# EAGLE design BusCon (EAGLE 6.6.0)
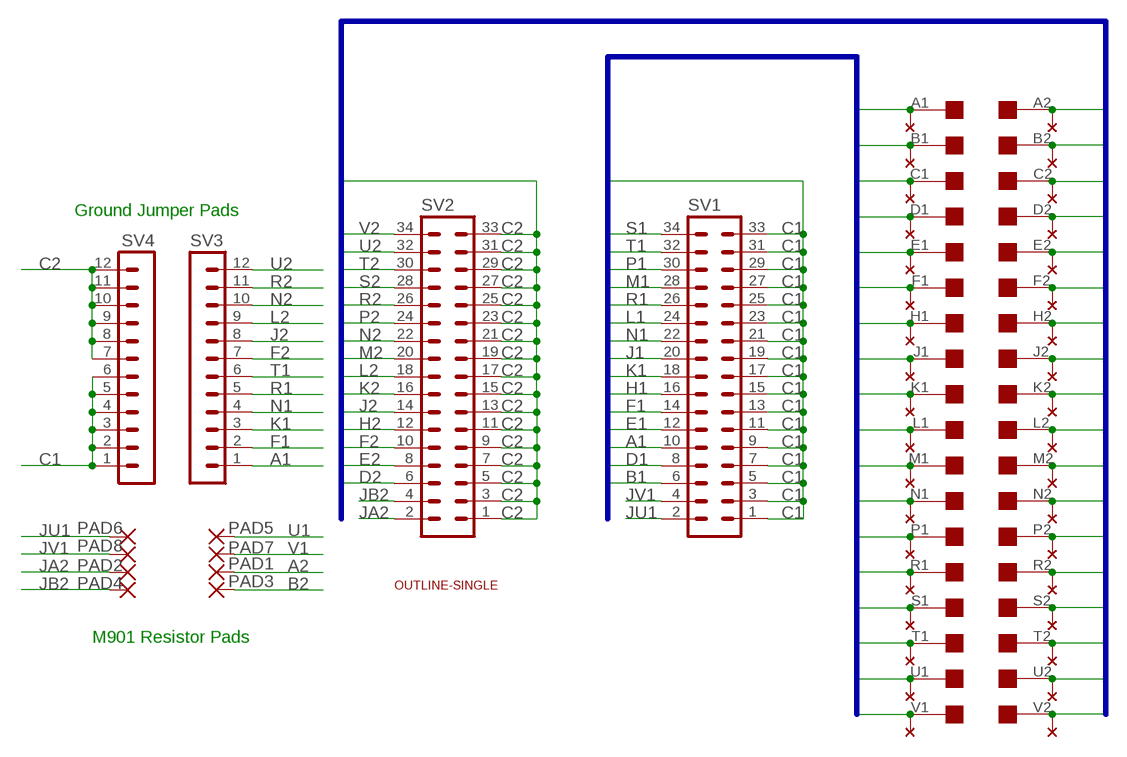
[diagram p0: schematic, sheet 1]

## Parts
PAD1  1,6/0,8  [1,6/0,8]
PAD2  1,6/0,8  [1,6/0,8]
PAD3  1,6/0,8  [1,6/0,8]
PAD4  1,6/0,8  [1,6/0,8]
PAD5  1,6/0,8  [1,6/0,8]
PAD6  1,6/0,8  [1,6/0,8]
PAD7  1,6/0,8  [1,6/0,8]
PAD8  1,6/0,8  [1,6/0,8]
SV1  MA17-2  [MA17-2]
SV2  MA17-2  [MA17-2]
SV3  MA12-1  [MA12-1]
SV4  MA12-1  [MA12-1]
U$1  OUTLINE-SINGLE  [SINGLE]
U$4  SINGLE  [EDGE-CON2]
U$5  THRU-HOLE2C  [THRU-HOLEC]

## Nets
A1: SV1.10 SV3.1 U$4.A1 U$5.A1
A2: PAD1.1(P) U$4.A2 U$5.A2
B1: SV1.6 U$4.B1 U$5.B1
B2: PAD3.1(P) U$4.B2 U$5.B2
C1: SV1.1 SV1.3 SV1.5 SV1.7 SV1.9 SV1.11 SV1.13 SV1.15 SV1.17 SV1.19 SV1.21 SV1.23 SV1.25 SV1.27 SV1.29 SV1.31 SV1.33 SV4.1 SV4.2 SV4.3 SV4.4 SV4.5 SV4.6 U$4.C1 U$5.C1
C2: SV2.1 SV2.3 SV2.5 SV2.7 SV2.9 SV2.11 SV2.13 SV2.15 SV2.17 SV2.19 SV2.21 SV2.23 SV2.25 SV2.27 SV2.29 SV2.31 SV2.33 SV4.7 SV4.8 SV4.9 SV4.10 SV4.11 SV4.12 U$4.C2 U$5.C2
D1: SV1.8 U$4.D1 U$5.D1
D2: SV2.6 U$4.D2 U$5.D2
E1: SV1.12 U$4.E1 U$5.E1
E2: SV2.8 U$4.E2 U$5.E2
F1: SV1.14 SV3.2 U$4.F1 U$5.F1
F2: SV2.10 SV3.7 U$4.F2 U$5.F2
H1: SV1.16 U$4.H1 U$5.H1
H2: SV2.12 U$4.H2 U$5.H2
J1: SV1.20 U$4.J1 U$5.J1
J2: SV2.14 SV3.8 U$4.J2 U$5.J2
JA2: PAD2.1(P) SV2.2
JB2: PAD4.1(P) SV2.4
JU1: PAD6.1(P) SV1.2
JV1: PAD8.1(P) SV1.4
K1: SV1.18 SV3.3 U$4.K1 U$5.K1
K2: SV2.16 U$4.K2 U$5.K2
L1: SV1.24 U$4.L1 U$5.L1
L2: SV2.18 SV3.9 U$4.L2 U$5.L2
M1: SV1.28 U$4.M1 U$5.M1
M2: SV2.20 U$4.M2 U$5.M2
N1: SV1.22 SV3.4 U$4.N1 U$5.N1
N2: SV2.22 SV3.10 U$4.N2 U$5.N2
P1: SV1.30 U$4.P1 U$5.P1
P2: SV2.24 U$4.P2 U$5.P2
R1: SV1.26 SV3.5 U$4.R1 U$5.R1
R2: SV2.26 SV3.11 U$4.R2 U$5.R2
S1: SV1.34 U$4.S1 U$5.S1
S2: SV2.28 U$4.S2 U$5.S2
T1: SV1.32 SV3.6 U$4.T1 U$5.T1
T2: SV2.30 U$4.T2 U$5.T2
U1: PAD5.1(P) U$4.U1 U$5.U1
U2: SV2.32 SV3.12 U$4.U2 U$5.U2
V1: PAD7.1(P) U$4.V1 U$5.V1
V2: SV2.34 U$4.V2 U$5.V2

## Buses
A1,B1,C1,D1,E1,F1,H1,J1,K1,L1,M1,N1,P1,R1,S1,T1,U1,V1
A2,B2,C2,D2,E2,F2,H2,J2,K2,L2,M2,N2,P2,R2,S2,T2,U2,V2

## Notes on the sheet
- Ground Jumper Pads
- M901 Resistor Pads

## Library data of the parts
PAD1-PAD8 = wirepad:1,6/0,8: THROUGH-HOLE PAD
SV1 SV2 = con-lstb:MA17-2: PIN HEADER; OC_FARNELL: unknown; OC_NEWARK: unknown
SV3 SV4 = con-lstb:MA12-1: PIN HEADER; OC_FARNELL: unknown; OC_NEWARK: unknown
U$1 = dec-con:OUTLINE-*: Board outlines for DEC boards.
U$4 = dec-con:SINGLE: Single-Height DEC board
U$5 = dec-con:THRU-HOLE2: Thru-Hole addition to double-sided edge connector.

## Board
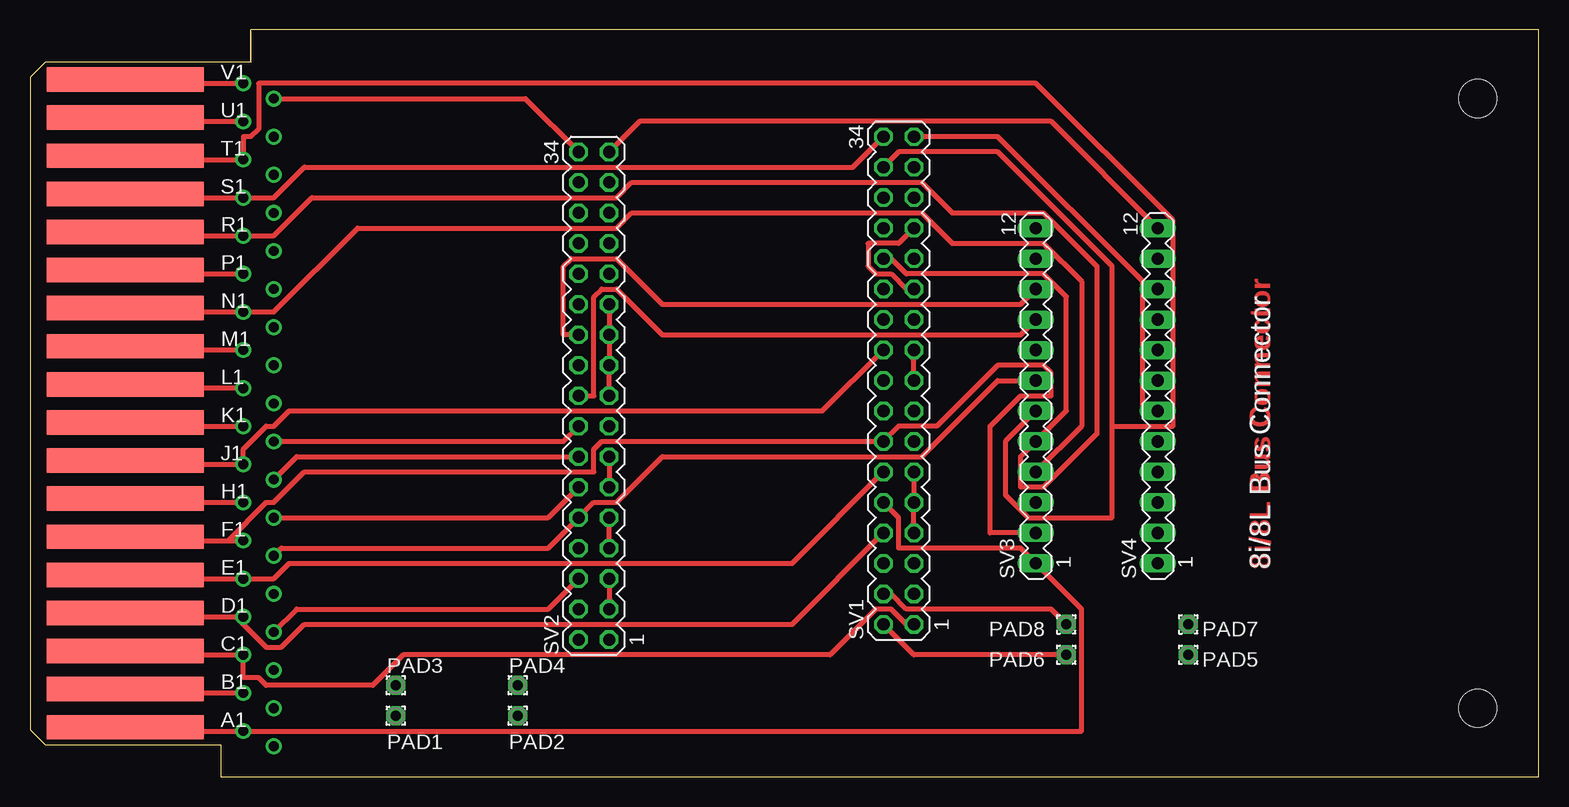
[diagram p1: board, top side]
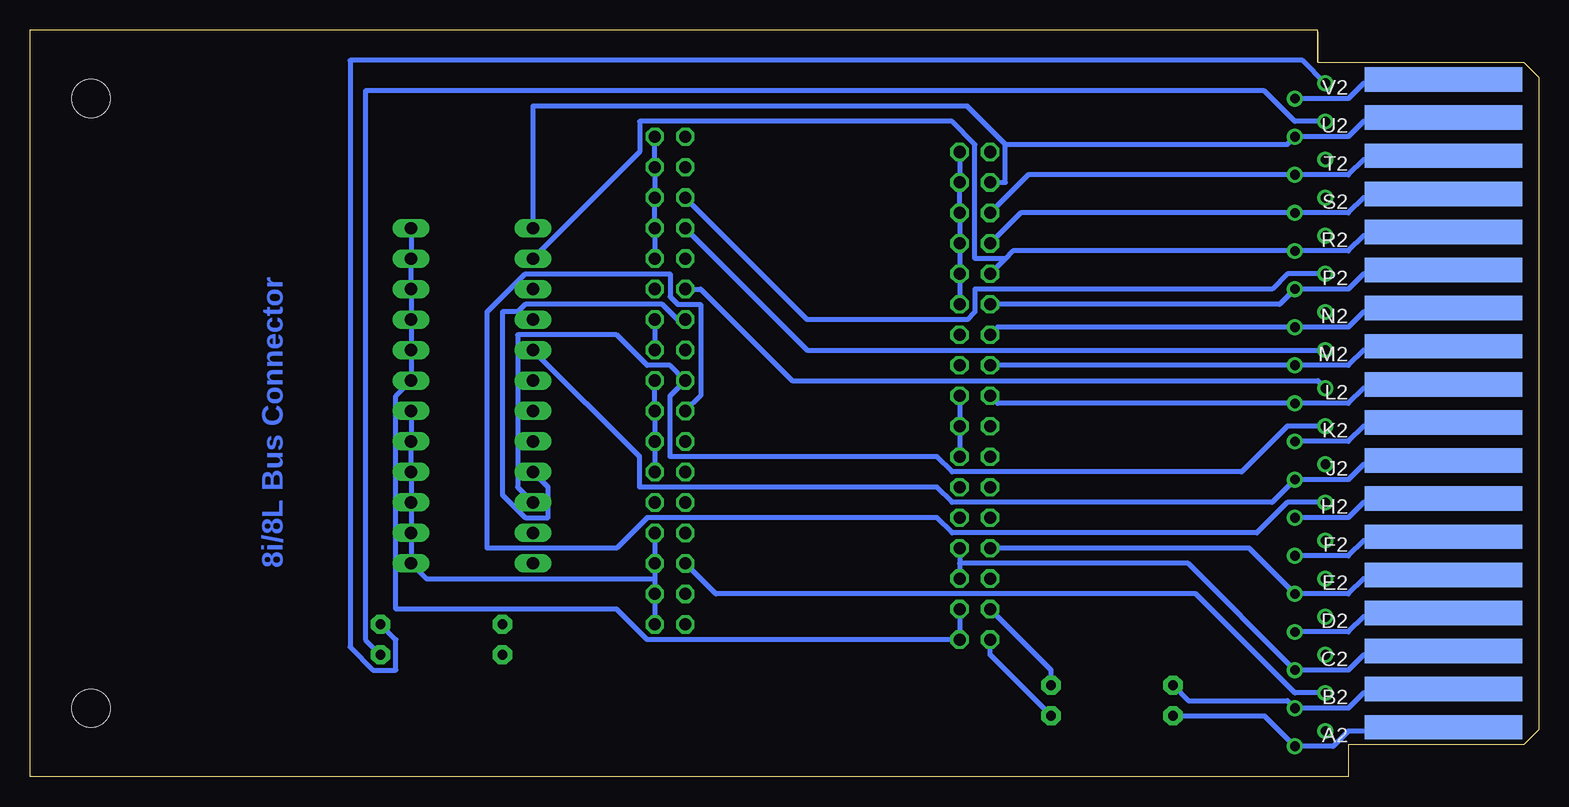
[diagram p2: board, bottom side, seen from below]

Size 125.73 x 62.23 mm. Coordinates in mm from the lower left corner, seen from the top.
Copper layers (1+16): Top 0.035mm / dielectric 1.5mm / Bottom 0.035mm
Design rules "16mils": minimum track width 16mil, minimum drill 32mil, track to track 15mil, track to pad 10mil, pad to pad 10mil, via to via 10mil, smd to smd 10mil, copper to edge 13mil, drill to drill 10mil, minimum pad ring 10mil, minimum via ring 8mil, stop-mask expansion 0mil, vias tented up to drill 0mil, thermal gap 10mil

### Footprints (pad centres in the part's own frame; a part is rotated, then mirrored left to right if it is on the bottom)
1,6/0,8 = drill 0.813 pad 1.6 octagon: 1 0,0
MA17-2 = drill 1.016 octagon: 1 -20.32,-1.27; 2 -20.32,1.27; 3 -17.78,-1.27; 4 -17.78,1.27; 5 -15.24,-1.27; 6 -15.24,1.27; 7 -12.7,-1.27; 8 -12.7,1.27; 9 -10.16,-1.27; 10 -10.16,1.27; 11 -7.62,-1.27; 12 -7.62,1.27; 13 -5.08,-1.27; 14 -5.08,1.27; 15 -2.54,-1.27; 16 -2.54,1.27; 17 0,-1.27; 18 0,1.27; 19 2.54,-1.27; 20 2.54,1.27; 21 5.08,-1.27; 22 5.08,1.27; 23 7.62,-1.27; 24 7.62,1.27; 25 10.16,-1.27; 26 10.16,1.27; 27 12.7,-1.27; 28 12.7,1.27; 29 15.24,-1.27; 30 15.24,1.27; 31 17.78,-1.27; 32 17.78,1.27; 33 20.32,-1.27; 34 20.32,1.27
MA12-1 = drill 1.016 long: 1 -13.97,0; 2 -11.43,0; 3 -8.89,0; 4 -6.35,0; 5 -3.81,0; 6 -1.27,0; 7 1.27,0; 8 3.81,0; 9 6.35,0; 10 8.89,0; 11 11.43,0; 12 13.97,0
SINGLE = hole 3.175: 120.65,56.515; 120.65,5.715
EDGE-CON2 = smd 13.106 x 2.032: A1 7.938,4.128; B1 7.938,7.303; C1 7.938,10.477; D1 7.938,13.652; E1 7.938,16.828; F1 7.938,20.003; H1 7.938,23.177; J1 7.938,26.352; K1 7.938,29.527; L1 7.938,32.703; M1 7.938,35.877; N1 7.938,39.053; P1 7.938,42.227; R1 7.938,45.403; S1 7.938,48.578; T1 7.938,51.752; U1 7.938,54.928; V1 7.938,58.102 | smd 13.106 x 2.032 bottom: A2 7.938,4.128; B2 7.938,7.303; C2 7.938,10.477; D2 7.938,13.652; E2 7.938,16.828; F2 7.938,20.003; H2 7.938,23.177; J2 7.938,26.352; K2 7.938,29.527; L2 7.938,32.703; M2 7.938,35.877; N2 7.938,39.053; P2 7.938,42.227; R2 7.938,45.403; S2 7.938,48.578; T2 7.938,51.752; U2 7.938,54.928; V2 7.938,58.102
THRU-HOLEC = drill 0.813 pad 1.27: A1 17.78,3.81; A2 20.32,2.54; B1 17.78,6.985; B2 20.32,5.715; C1 17.78,10.16; C2 20.32,8.89; D1 17.78,13.335; D2 20.32,12.065; E1 17.78,16.51; E2 20.32,15.24; F1 17.78,19.685; F2 20.32,18.415; H1 17.78,22.86; H2 20.32,21.59; J1 17.78,26.035; J2 20.32,24.765; K1 17.78,29.21; K2 20.32,27.94; L1 17.78,32.385; L2 20.32,31.115; M1 17.78,35.56; M2 20.32,34.29; N1 17.78,38.735; N2 20.32,37.465; P1 17.78,41.91; P2 20.32,40.64; R1 17.78,45.085; R2 20.32,43.815; S1 17.78,48.26; S2 20.32,46.99; T1 17.78,51.435; T2 20.32,50.165; U1 17.78,54.61; U2 20.32,53.34; V1 17.78,57.785; V2 20.32,56.515

### Placement (x,y rotation side)
PAD1  30.48,5.08 0 top
PAD2  40.64,5.08 0 top
PAD3  30.48,7.62 0 top
PAD4  40.64,7.62 0 top
PAD5  96.52,10.16 180 top
PAD6  86.36,10.16 180 top
PAD7  96.52,12.7 180 top
PAD8  86.36,12.7 180 top
SV1  72.39,33.02 90 top
SV2  46.99,31.75 90 top
SV3  83.82,31.75 90 top
SV4  93.98,31.75 90 top
U$1  0,0 0 top
U$4  0,0 0 top
U$5  0,0 0 top

### Tracks (layer width: path | path; a pad name or v marks a point on that pad's centre or on a via)
A1
  Top 0.406: SV1.10 72.39,21.59 72.39,19.05 82.55,19.05 SV3.1 87.63,13.97 87.63,3.81 U$5.A1 8.26,3.81 U$4.A1
A2
  Bottom 0.406: PAD1.1 22.86,5.08 U$5.A2 17.15,2.54 15.88,3.81 8.26,3.81 U$4.A2
B1
  Top 0.406: U$5.B1 8.26,6.99 U$4.B1
  Bottom 0.406: SV1.6 68.58,15.24 28.58,15.24 20.32,6.99 U$5.B1
B2
  Bottom 0.406: PAD3.1 29.21,6.35 20.96,6.35 U$5.B2 15.88,5.71 14.61,6.99 8.26,6.99 U$4.B2
C1
  Top 0.406: U$4.C1 8.26,10.16 U$5.C1 17.78,8.26 19.05,8.26 19.69,7.62 28.58,7.62 31.12,10.16 66.68,10.16 70.49,13.97 71.76,13.97 73.03,12.7 SV1.1 | SV1.11 SV1.9 SV1.7 | SV1.17 SV1.19 | SV1.23 73.03,40.64 71.76,41.91 70.49,41.91 69.85,42.55 69.85,44.45 72.39,44.45 SV1.27 | SV1.33 80.65,53.34 92.71,41.27 92.71,30.48 SV4.6
  Bottom 0.406: SV1.21 SV1.19 | SV1.17 SV1.15 SV1.13 SV1.11 | SV1.33 SV1.31 SV1.29 SV1.27 SV1.25 | SV1.1 SV1.3 73.66,16.51 | SV1.7 SV1.5 73.66,16.51 | SV4.6 SV4.5 SV4.4 SV4.3 SV4.2 SV4.1 92.71,16.51 73.66,16.51
C2
  Top 0.406: SV2.13 SV2.11 | SV2.17 SV2.19 SV2.21 SV2.23 | SV2.7 SV2.9 | SV2.5 SV2.3 | SV2.33 50.8,54.61 85.09,54.61 SV4.12
  Bottom 0.406: SV2.17 SV2.15 SV2.13 | SV2.33 SV2.31 SV2.29 SV2.27 SV2.25 SV2.23 | SV4.12 SV4.11 SV4.10 SV4.9 SV4.8 SV4.7 95.25,31.75 95.25,13.97 76.84,13.97 74.3,11.43 SV2.1 SV2.3 | SV2.7 48.26,17.78 | 48.26,17.78 SV2.5 | U$4.C2 8.26,10.16 14.61,10.16 15.88,8.89 U$5.C2 29.21,17.78 48.26,17.78
D1
  Top 0.406: 17.15,13.34 8.26,13.34 U$4.D1 | SV1.8 63.5,12.7 22.86,12.7 20.96,10.79 19.69,10.79 17.15,13.34 | 17.15,13.34 U$5.D1
D2
  Top 0.406: SV2.6 43.18,13.97 22.23,13.97 U$5.D2
  Bottom 0.406: U$5.D2 15.88,12.06 14.61,13.34 8.26,13.34 U$4.D2
E1
  Top 0.406: U$4.E1 8.26,16.51 U$5.E1 20.32,16.51 21.59,17.78 63.5,17.78 SV1.12
E2
  Bottom 0.406: U$4.E2 8.26,16.51 14.61,16.51 15.88,15.24 U$5.E2 24.13,19.05 SV2.8
F1
  Top 0.406: SV3.2 80.01,20.32 80.01,29.21 82.55,31.75 85.09,31.75 85.09,33.66 84.46,34.29 80.65,34.29 75.57,29.21 72.39,29.21 SV1.14 47.63,27.94 46.99,27.3 46.99,25.4 22.86,25.4 20.32,22.86 19.69,22.86 16.51,19.68 | 16.51,19.68 8.26,19.68 U$4.F1 | 16.51,19.68 U$5.F1
F2
  Top 0.406: U$5.F2 20.96,19.05 43.18,19.05 SV2.10 46.99,22.86 48.9,22.86 52.71,26.67 74.3,26.67 80.65,33.02 SV3.7
  Bottom 0.406: U$5.F2 15.88,18.41 14.61,19.68 8.26,19.68 U$4.F2
H1
  Top 0.406: U$5.H1 8.26,22.86 U$4.H1
  Bottom 0.406: SV1.16 69.85,31.75 69.85,39.37 71.76,39.37 72.39,40.01 72.39,41.91 84.46,41.91 87.63,38.73 87.63,19.05 76.84,19.05 74.3,21.59 50.17,21.59 48.9,20.32 23.5,20.32 20.96,22.86 U$5.H1
H2
  Top 0.406: SV2.12 43.18,21.59 U$5.H2
  Bottom 0.406: U$5.H2 15.88,21.59 14.61,22.86 8.26,22.86 U$4.H2
J1
  Top 0.406: U$4.J1 8.26,26.04 16.51,26.04 U$5.J1 17.78,27.3 19.69,29.21 20.32,29.21 21.59,30.48 66.04,30.48 SV1.20
J2
  Top 0.406: SV2.14 22.23,26.67 U$5.J2
  Bottom 0.406: U$4.J2 8.26,26.04 14.61,26.04 15.88,24.77 U$5.J2 22.23,22.86 48.9,22.86 50.17,24.13 74.93,24.13 74.93,26.67 SV3.8
JA2
  Bottom 0.406: SV2.2 45.72,10.16 PAD2.1
JB2
  Bottom 0.406: SV2.4 40.64,8.89 PAD4.1
JU1
  Top 0.406: SV1.2 73.66,10.16 PAD6.1
JV1
  Top 0.406: SV1.4 71.76,15.24 73.03,13.97 85.09,13.97 PAD8.1
K1
  Top 0.406: U$5.K1 8.26,29.21 U$4.K1
  Bottom 0.406: SV3.3 85.09,24.13 85.09,36.83 76.84,36.83 74.3,34.29 72.39,34.29 SV1.18 72.39,31.75 72.39,26.67 50.17,26.67 48.9,25.4 24.77,25.4 20.96,29.21 U$5.K1
K2
  Top 0.406: SV2.16 44.45,27.94 U$5.K2
  Bottom 0.406: U$5.K2 15.88,27.94 14.61,29.21 8.26,29.21 U$4.K2
L1
  Top 0.406: U$5.L1 8.26,32.38 U$4.L1
  Bottom 0.406: U$5.L1 18.42,33.02 62.23,33.02 69.85,40.64 SV1.24
L2
  Top 0.406: SV3.9 82.55,36.83 52.71,36.83 48.9,40.64 47.63,40.64 46.99,40.01 46.99,31.75 SV2.18
  Bottom 0.406: U$4.L2 8.26,32.38 14.61,32.38 15.88,31.11 U$5.L2 45.09,31.11 SV2.18
M1
  Top 0.406: U$5.M1 8.26,35.56 U$4.M1
  Bottom 0.406: U$5.M1 60.96,35.56 SV1.28
M2
  Bottom 0.406: U$4.M2 8.26,35.56 14.61,35.56 15.88,34.29 U$5.M2 SV2.20
N1
  Top 0.406: U$4.N1 8.26,38.73 U$5.N1 20.32,38.73 27.31,45.72 48.9,45.72 50.17,46.99 74.3,46.99 76.84,44.45 84.46,44.45 87.63,41.27 87.63,29.21 SV3.4
  Bottom 0.406: SV3.4 82.55,24.13 82.55,21.59 84.46,21.59 86.36,23.5 86.36,38.73 85.09,38.73 84.46,39.37 73.03,39.37 71.76,38.1 SV1.22
N2
  Top 0.406: SV3.10 82.55,39.37 52.71,39.37 48.9,43.18 45.09,43.18 44.45,42.55 44.45,36.83 SV2.22
  Bottom 0.406: U$4.N2 8.26,38.73 14.61,38.73 15.88,37.47 U$5.N2 45.09,37.47 SV2.22
P1
  Top 0.406: U$5.P1 8.26,41.91 U$4.P1
  Bottom 0.406: SV1.30 60.96,38.1 47.63,38.1 46.99,38.73 46.99,40.64 22.23,40.64 20.96,41.91 U$5.P1
P2
  Bottom 0.406: U$4.P2 8.26,41.91 14.61,41.91 15.88,40.64 U$5.P2 21.59,39.37 SV2.24
R1
  Top 0.406: SV1.26 71.76,43.18 73.03,41.91 84.46,41.91 86.36,40.01 86.36,30.48 SV3.5 82.55,26.67 82.55,24.13 84.46,24.13 88.9,28.57 88.9,42.55 84.46,46.99 76.84,46.99 74.3,49.53 50.17,49.53 48.9,48.26 23.5,48.26 20.32,45.09 U$5.R1 8.26,45.09 U$4.R1
R2
  Bottom 0.406: U$4.R2 8.26,45.09 14.61,45.09 15.88,43.81 U$5.R2 43.82,43.81 44.45,43.18 | 44.45,43.18 SV2.26 | SV3.11 74.93,52.07 74.93,54.61 48.9,54.61 46.99,52.7 46.99,43.18 44.45,43.18
S1
  Top 0.406: U$4.S1 8.26,48.26 U$5.S1 20.32,48.26 22.86,50.8 68.58,50.8 SV1.34
S2
  Bottom 0.406: U$4.S2 8.26,48.26 14.61,48.26 15.88,46.99 U$5.S2 43.18,46.99 SV2.28
T1
  Top 0.406: U$4.T1 8.26,51.44 U$5.T1 17.78,53.34 18.42,53.34 19.05,53.98 19.05,57.78 83.82,57.78 95.25,46.35 95.25,29.21 90.17,29.21 | SV1.32 72.39,52.07 80.65,52.07 90.17,42.55 90.17,29.21 | 90.17,29.21 90.17,21.59 83.19,21.59 81.28,23.5 81.28,27.94 SV3.6
T2
  Bottom 0.406: U$4.T2 8.26,51.44 14.61,51.44 15.88,50.16 U$5.T2 42.55,50.16 SV2.30
U1
  Top 0.406: U$5.U1 8.26,54.61 U$4.U1
  Bottom 0.406: PAD5.1 97.79,11.43 97.79,57.15 22.86,57.15 20.32,54.61 U$5.U1
U2
  Bottom 0.406: U$4.U2 8.26,54.61 14.61,54.61 15.88,53.34 U$5.U2 20.96,52.7 44.45,52.7 | SV3.12 83.82,55.88 47.63,55.88 44.45,52.7 | 44.45,52.7 44.45,49.53 SV2.32
V1
  Top 0.406: U$5.V1 8.26,57.78 U$4.V1
  Bottom 0.406: PAD7.1 95.25,11.43 95.25,8.89 97.16,8.89 99.06,10.79 99.06,59.69 19.69,59.69 U$5.V1
V2
  Top 0.406: SV2.34 41.28,56.52 U$5.V2
  Bottom 0.406: U$5.V2 15.88,56.52 14.61,57.78 8.26,57.78 U$4.V2

### Text on the board
Top: 8i/8L Bus Connector
Bottom: 8i/8L Bus Connector
tPlace: 8i/8L Bus Connector
tValues: Jumper unless M901 | M90x/W0x1 - always used | M901/M903/M904 - Use both | M901 | (res) | M901 | (res)